# EAGLE design tamiya_camrobo_face (EAGLE 9.1.3)
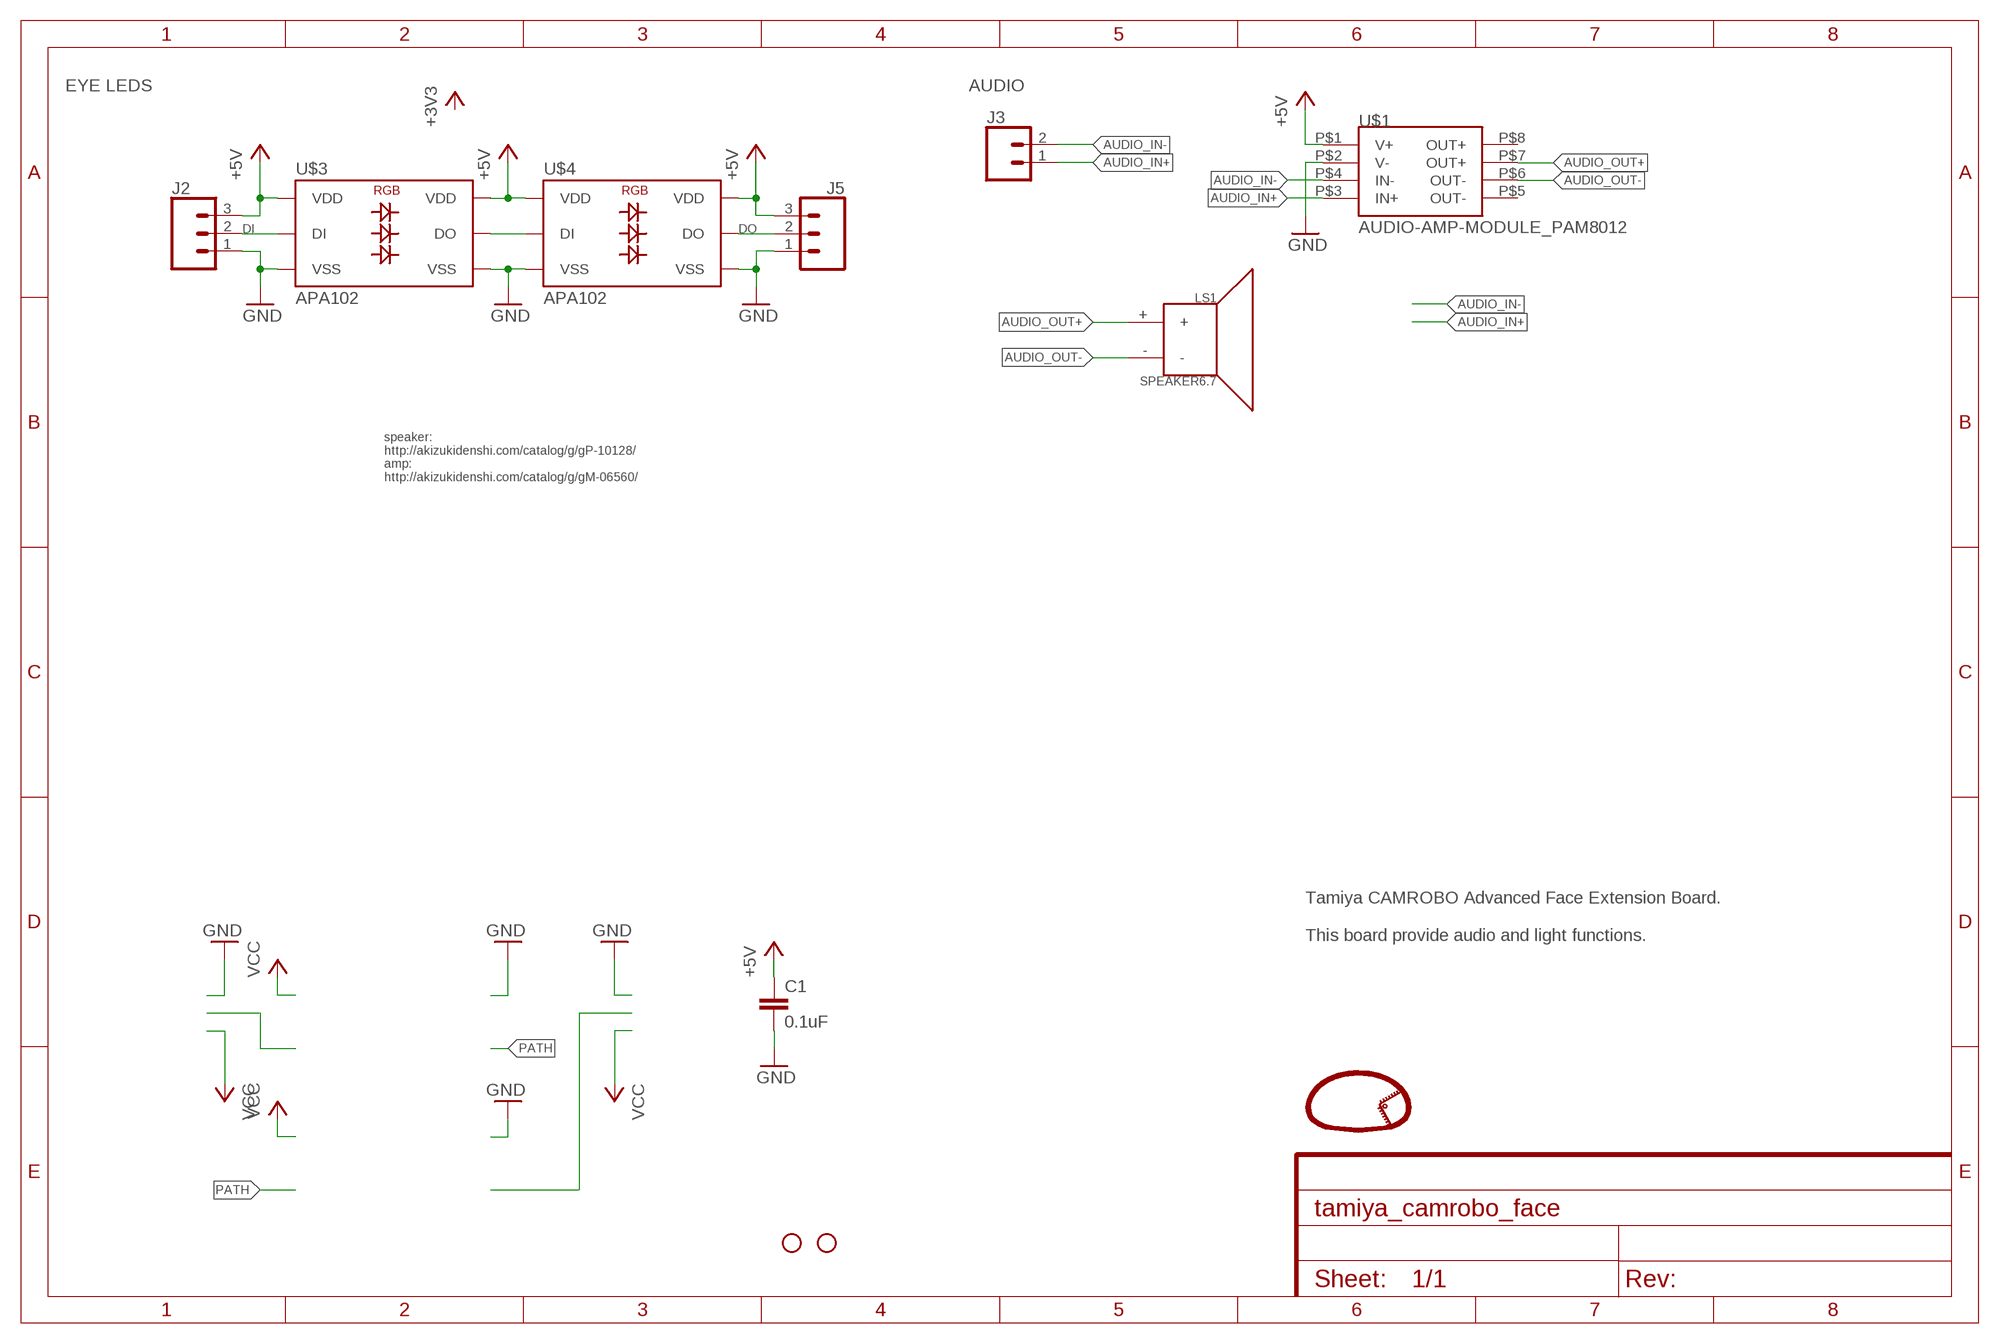
[diagram p0: schematic, sheet 1]

## Parts
C1  0.1uF  0.1UF-KIT-EZ-50V-20%  [CAP-PTH-SMALL-KIT]
H1  STAND-OFF  [STAND-OFF]
H2  STAND-OFF  [STAND-OFF]
J2  CONN_03  [1X03]
J3  CONN_02  [1X02]
J5  CONN_03  [1X03]
LS1  SPEAKER6.7  [SPEAKER-6.7MM]
U$1  AUDIO-AMP-MODULE_PAM8012  [AE-PAM8012]
U$2  LOGO  [LOGO]
U$3  APA102  [APA102-STRIP-ELEMENT]
U$4  APA102  [APA102-STRIP-ELEMENT]

## Nets
+5V: C1.1 J2.3 J5.3 U$1.P$1(V+) U$3.P$1(VDD) U$3.P$6(VDD) U$4.P$1(VDD) U$4.P$6(VDD)
AUDIO_IN+: J3.1 U$1.P$3(IN+)
AUDIO_IN-: J3.2 U$1.P$4(IN-)
AUDIO_OUT+: LS1.+ U$1.P$7(OUT+)
AUDIO_OUT-: LS1.- U$1.P$6(OUT-)
DI: J2.2 U$3.P$5(DI)
DO: J5.2 U$4.P$2(DO)
GND: C1.2 J2.1 J5.1 U$1.P$2(V-) U$3.P$3(VSS) U$3.P$4(VSS) U$4.P$3(VSS) U$4.P$4(VSS)
N$1: U$3.P$2(DO) U$4.P$5(DI)
Unconnected: U$1.P$5(OUT-) U$1.P$8(OUT+)

## Notes on the sheet
- EYE LEDS | AUDIO
- speaker: 
  http://akizukidenshi.com/catalog/g/gP-10128/
  amp: 
  http://akizukidenshi.com/catalog/g/gM-06560/
- Tamiya CAMROBO Advanced Face Extension Board.
  
  This board provide audio and light functions.

## Library data of the parts
C1 = SparkFun-Capacitors:0.1UF: 0.1µF ceramic capacitors A capacitor is a passive two-terminal electrical component used to store electrical energy temporarily in an electric field.; PROD_ID: CAP-08370
H1 H2 = SparkFun-Hardware:STAND-OFF: Stand Off Drill holes for mechanically mounting via screws, standoffs, etc. Note: Use the keepout ring to avoid running the screw head into surrounding components. Variant Overviews STAND-OFF - Mechanical footprint for a #4 phillips button head screw. STAND-OFF-TIGHT - Mechanical footprint for a #4 phillips button head screw, Example SparkFun Products Screw - Phillips Head (1/4", 4-40, 10 pack) <https://www.sparkfun.com/products/10453> (PRT-10453) Screw - Phillips Head (1/2", 4-40, 10 pack) <https://www.sparkfun.com/products/10452> (PRT-10452) Screw - Phillips Head (3/4", 4-40, 10 pack) <https://www.sparkfun.com/products/10451> (PRT-10451) Screw - Phillips Head (1", 4-40, 10 pack) <https://www.sparkfun.com/products/10450> (PRT-10450)
J2 J5 = SparkFun-Connectors:CONN_03: Multi connection point. Often used as Generic Header-pin footprint for 0.1 inch spaced/style header connections On any of the 0.1 inch spaced packages, you can populate with these: Break Away Headers - Straight <https://www.sparkfun.com/products/116> (PRT-00116) Break Away Male Headers - Right Angle <https://www.sparkfun.com/products/553> (PRT-00553) Female Headers <https://www.sparkfun.com/products/115> (PRT-00115) Break Away Headers - Machine Pin <https://www.sparkfun.com/products/117> (PRT-00117) Break Away Female Headers - Swiss Machine Pin <https://www.sparkfun.com/products/743> (PRT-00743) Stackable Header - 3 Pin (Female, 0.1") <https://www.sparkfun.com/products/13875> (PRT-13875) For SCREWTERMINALS and SPRING TERMINALS visit here: Screw Terimnals on SparkFun.com <https://www.sparkfun.com/search/results?term=Screw+Terminals> (5mm/3.5mm/2.54mm spacing) This device is also useful as a general connection point to wire up your design to another part of your project. Our various solder wires solder well into these plated through hole pads. Hook-Up Wire - Assortment (Stranded, 22 AWG) <https://www.sparkfun.com/products/11375> (PRT-11375) Hook-Up Wire - Assortment (Solid Core, 22 AWG) <https://www.sparkfun.com/products/11367> (PRT-11367) View the entire wire category on our website here <https://www.sparkfun.com/categories/141> Special notes: Molex polarized connector foot print use with SKU : PRT-08232 with associated crimp pins and housings.
J3 = SparkFun-Connectors:CONN_02: Multi connection point. Often used as Generic Header-pin footprint for 0.1 inch spaced/style header connections On any of the 0.1 inch spaced packages, you can populate with these: Break Away Headers - Straight <https://www.sparkfun.com/products/116> (PRT-00116) Break Away Male Headers - Right Angle <https://www.sparkfun.com/products/553> (PRT-00553) Female Headers <https://www.sparkfun.com/products/115> (PRT-00115) Break Away Headers - Machine Pin <https://www.sparkfun.com/products/117> (PRT-00117) Break Away Female Headers - Swiss Machine Pin <https://www.sparkfun.com/products/743> (PRT-00743) For SCREWTERMINALS and SPRING TERMINALS visit here: Screw Terimnals on SparkFun.com <https://www.sparkfun.com/search/results?term=Screw+Terminals> (5mm/3.5mm/2.54mm spacing) This device is also useful as a general connection point to wire up your design to another part of your project. Our various solder wires solder well into these plated through hole pads. Hook-Up Wire - Assortment (Stranded, 22 AWG) <https://www.sparkfun.com/products/11375> (PRT-11375) Hook-Up Wire - Assortment (Solid Core, 22 AWG) <https://www.sparkfun.com/products/11367> (PRT-11367) View the entire wire category on our website here <https://www.sparkfun.com/categories/141> Special notes: Molex polarized connector foot print use with: PRT-08233 with associated crimp pins and housings. 2.54_SCREWTERM for use with PRT-10571. 3.5mm Screw Terminal footprints for PRT-08084 5mm Screw Terminal footprints for use with PRT-08432
LS1 = Botamochi-sensors:SPEAKER
U$1 = Botamochi-sensors:AUDIO-AMP-MODULE_
U$2 = botamochi-symbol:LOGO
U$3 U$4 = Botamochi-sensors:APA102

## Board
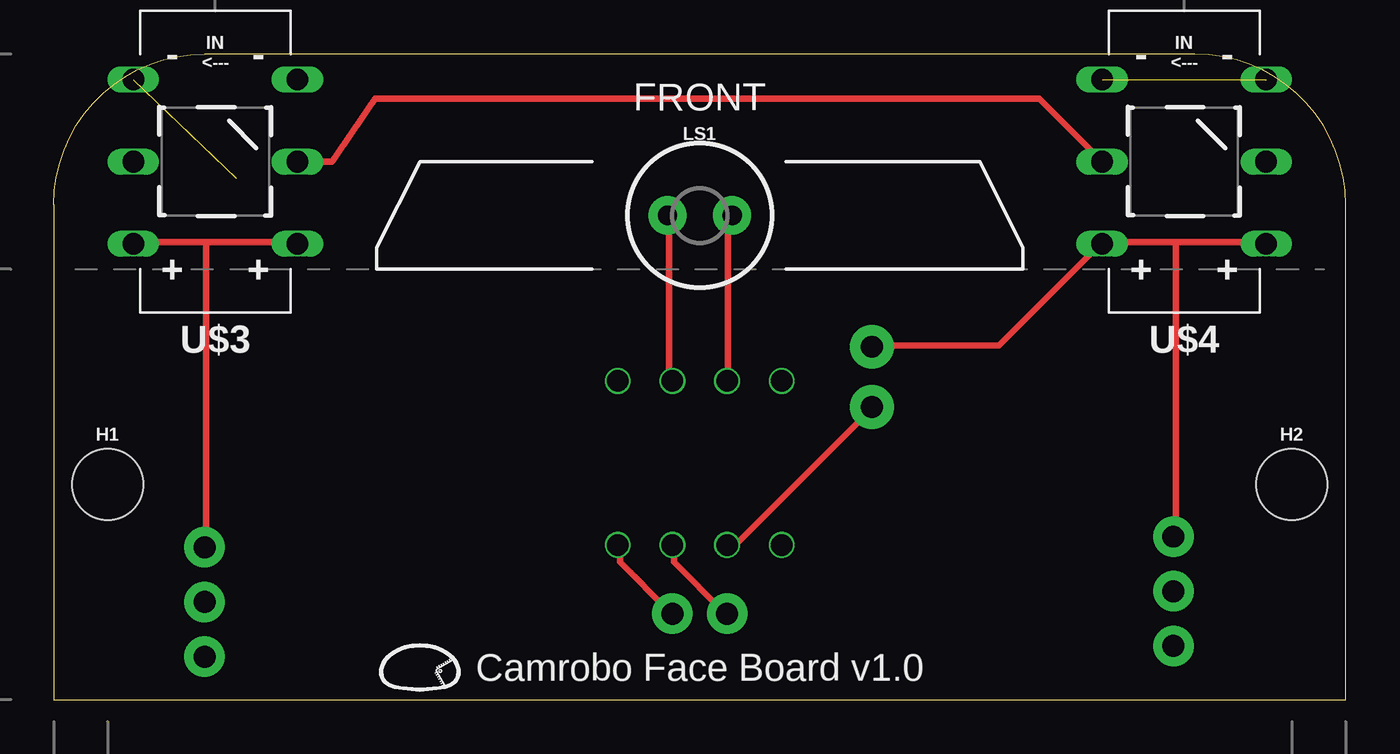
[diagram p1: board, top side]
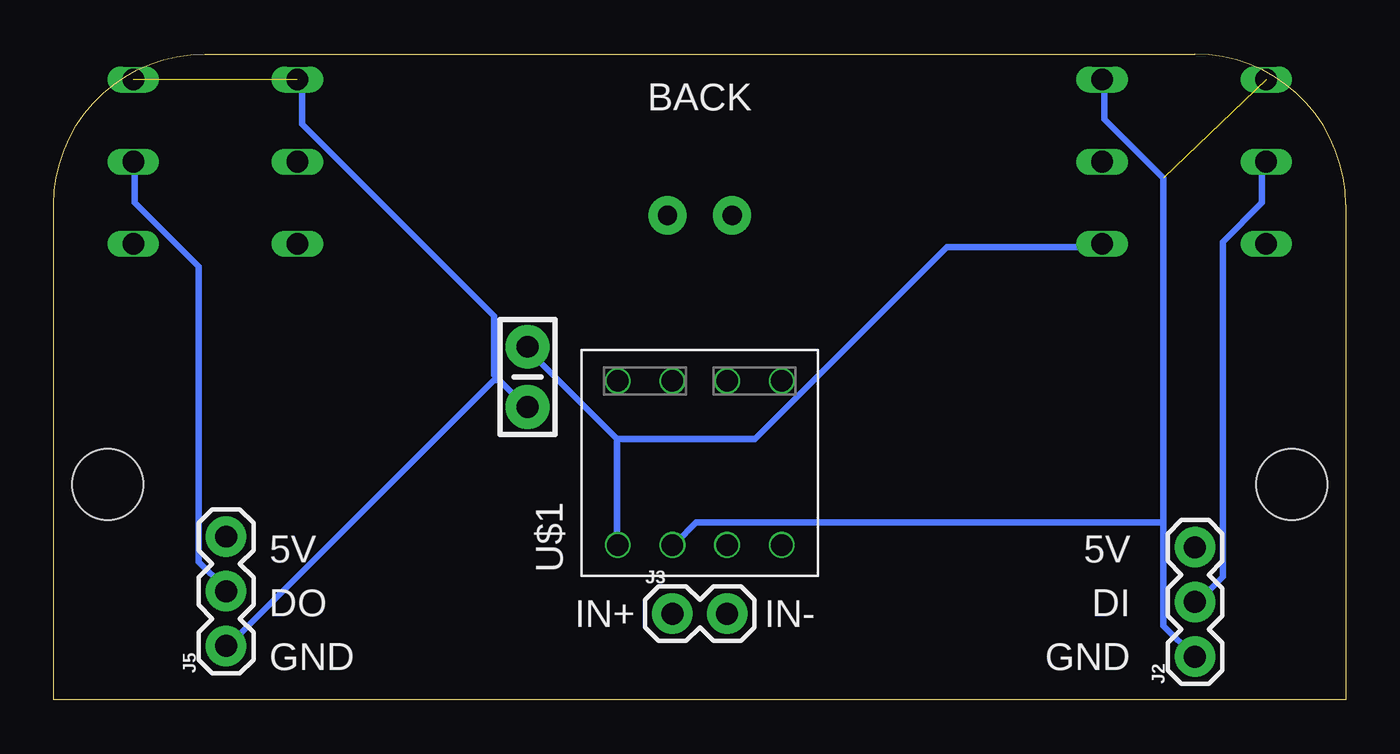
[diagram p2: board, bottom side, seen from below]

Size 60 x 30 mm. Coordinates in mm from the lower left corner, seen from the top.
Outline: 0,0 60,0 60,23 arc90 53,30 7,30 arc90 0,23 0,0
Copper layers (1*16): Top 0.035mm / dielectric 1.5mm / Bottom 0.035mm
Design rules "ssci_SeeedStudio_2layer_DRU_no_angle *": minimum track width 12mil, minimum drill 12mil, track to track 6mil, track to pad 6mil, pad to pad 6mil, via to via 6mil, smd to smd 0mil, copper to edge 10mil, drill to drill 10mil, minimum pad ring 1mil, minimum via ring 6mil, stop-mask expansion 2mil, vias tented up to drill 25mil, thermal gap 10mil

### Footprints (pad centres in the part's own frame; a part is rotated, then mirrored left to right if it is on the bottom)
CAP-PTH-SMALL-KIT = drill 1.016 pad 2.032: 1 -1.397,0; 2 1.397,0
STAND-OFF = hole 3.302: 0,0
1X03 = drill 1.016 pad 1.88: 1 0,0; 2 2.54,0; 3 5.08,0
1X02 = drill 1.016 pad 1.88: 1 0,0; 2 2.54,0
SPEAKER-6.7MM = drill 0.9 pad 1.778: + 1.5,0; - -1.5,0
AE-PAM8012 = drill 1: P$1 -3.81,3.81; P$2 -3.81,1.27; P$3 -3.81,-1.27; P$4 -3.81,-3.81; P$5 3.81,-3.81; P$6 3.81,-1.27; P$7 3.81,1.27; P$8 3.81,3.81
APA102-STRIP-ELEMENT = drill 1 long: P$1 -3.81,3.81; P$2 -3.81,0; P$3 -3.81,-3.81; P$4 3.81,-3.81; P$5 3.81,0; P$6 3.81,3.81

### Placement (x,y rotation side)
C1  38,15 270 bottom
H1  2.5,10 0 top
H2  57.5,10 0 top
J2  7,2 90 bottom
J3  31.27,4 0 bottom
J5  52,2.5 90 bottom
LS1  30,22.5 0 top
U$1  30,11 90 bottom
U$2  17,1.5 0 top
U$3  7.5,25 180 top
U$4  52.5,25 180 top

### Tracks (layer width: path | path; a pad name or v marks a point on that pad's centre or on a via)
+5V
  Top 0.305: 7.09,21.26 11.2,21.26 U$3.P$1 | 7.09,21.26 3.89,21.26 U$3.P$6 | 7.09,21.26 7.09,7.09 J2.3 | 52.12,21.26 56.24,21.26 U$4.P$1 | 52.12,21.26 48.69,21.26 U$4.P$6 48.46,21.03 43.89,16.46 38.18,16.46 C1.1 | 52.12,21.26 52.12,7.77 J5.3
  Bottom 0.305: 33.83,12.12 33.83,7.32 U$1.P$1 | 33.83,12.12 37.95,16.23 C1.1 | 33.83,12.12 27.43,12.12 18.52,21.03 11.43,21.03 U$3.P$1
AUDIO_IN+
  Top 0.305: U$1.P$3 28.8,7.09 28.8,6.4 31.09,4.12 J3.1
AUDIO_IN-
  Top 0.305: U$1.P$4 26.29,7.09 26.29,6.4 28.57,4.12 J3.2
AUDIO_OUT+
  Top 0.305: U$1.P$7 31.32,14.86 31.32,22.4 LS1.+
AUDIO_OUT-
  Top 0.305: U$1.P$6 28.57,14.86 28.57,22.4 LS1.-
DI
  Bottom 0.305: U$3.P$5 3.89,24.92 3.89,23.09 5.71,21.26 5.71,5.71 6.86,4.57 J2.2
DO
  Bottom 0.305: U$4.P$2 56.24,24.92 56.24,23.09 53.26,20.12 53.26,6.4 52.12,5.26 J5.2
GND  (2 unrouted)
  Top 0.305: U$1.P$2 31.32,7.32 31.77,7.32 37.95,13.49 C1.2
  Bottom 0.305: 8.46,8.23 8.46,3.43 7.09,2.06 J2.1 | 8.46,8.23 8.46,24.23 11.2,26.98 11.2,28.8 U$3.P$3 | 39.32,14.86 38.18,13.72 C1.2 | 39.32,14.86 39.55,15.09 39.55,17.83 48.46,26.75 48.46,28.8 U$4.P$4 | 39.32,14.86 39.55,14.86 51.89,2.52 J5.1 | 8.46,8.23 30.18,8.23 31.09,7.32 U$1.P$2
N$1
  Top 0.305: U$3.P$2 12.92,25 14.93,27.92 45.77,27.92 U$4.P$5

### Text on the board
tNames: FRONT | Camrobo Face Board v1.0
bNames: BACK | 5V | 5V | DI | IN- | IN+ | DO | GND | GND